# Altium schematic sheet Overview.SchDoc
size A; SheetNumber: 1; SheetTotal: 4
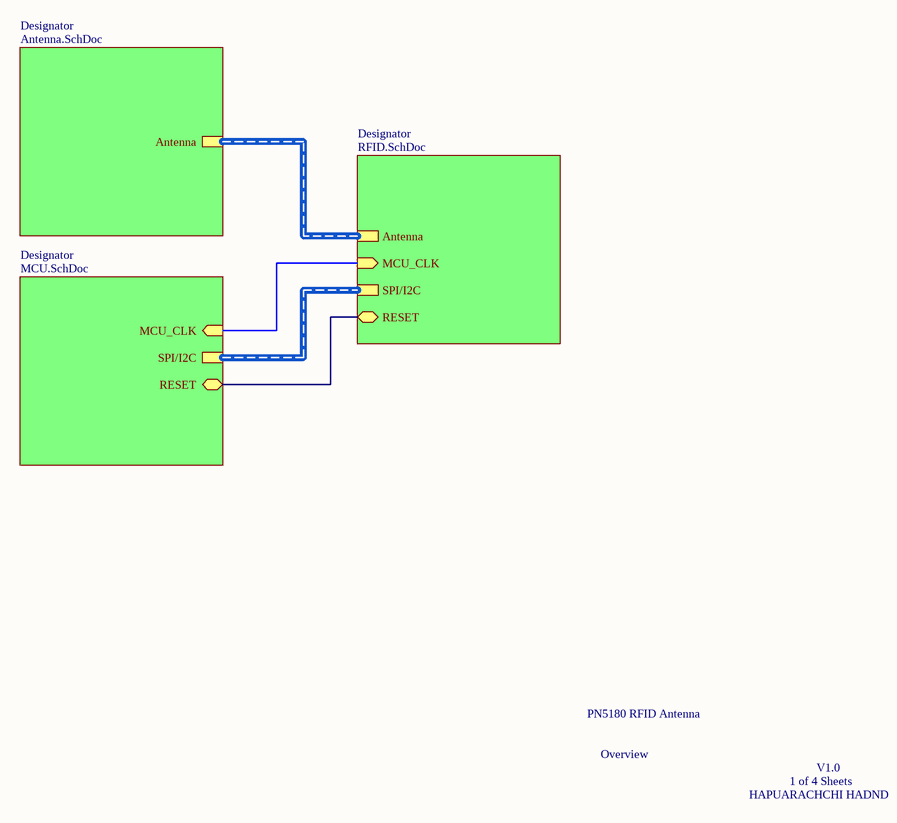
[diagram p0: Overview.SchDoc]

## Sub-sheets
Designator = Antenna.SchDoc: Antenna (harness Antenna)
Designator = RFID.SchDoc: Antenna (harness Antenna), MCU_CLK (in), SPI/I2C (harness SPI/I2C), RESET (bidir)
Designator = MCU.SchDoc: MCU_CLK (in), SPI/I2C (harness SPI/I2C), RESET (bidir)

## Nets
(unnamed): sheet Designator/MCU_CLK, sheet Designator/MCU_CLK
(unnamed): sheet Designator/RESET, sheet Designator/RESET

## Notes on the sheet
- PN5180 RFID Antenna
- Overview
- 1 of 4 Sheets
- V1.0
- HAPUARACHCHI HADND